# Altium schematic sheet 442MHz-450MHz_BPF.SchDoc
size A4; SheetNumber: 7; SheetTotal: 13
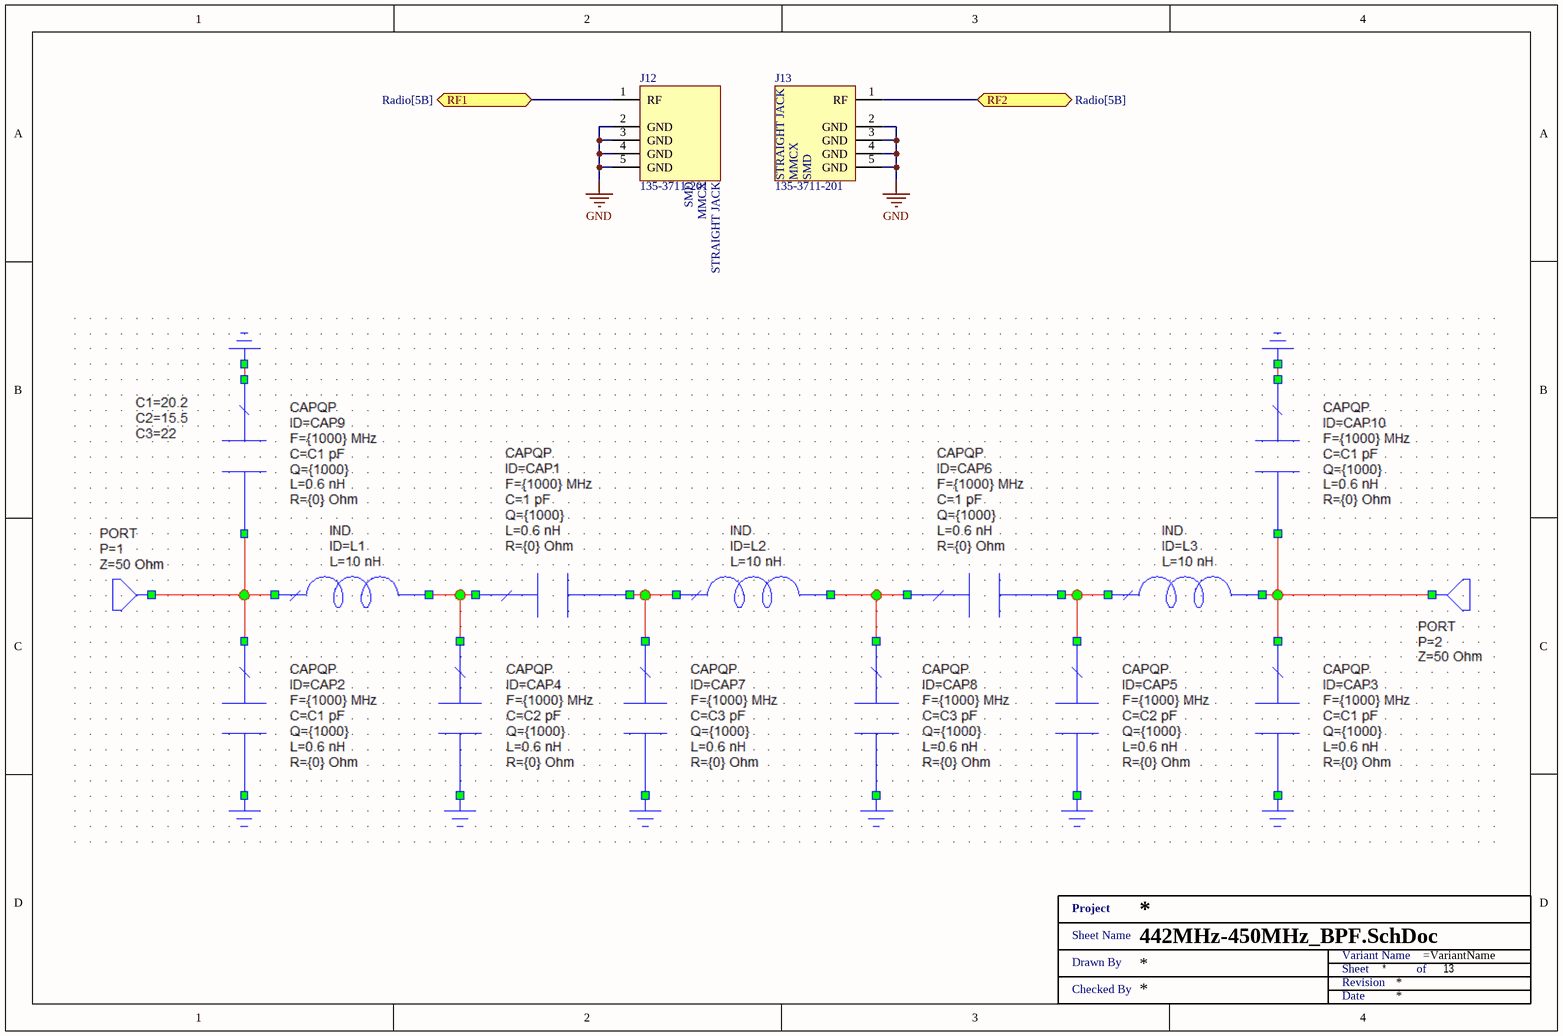
[diagram p0: 442MHz-450MHz_BPF.SchDoc]

## Parts
J12  135-3711-201  [135-3711-201]
J13  135-3711-201  [135-3711-201]
XX?  Title 1  (value not drawn)  (graphical)

## Ports
RF1 (bidir, see Radio[5B]), RF2 (bidir, see Radio[5B])

## Nets
GND: J12.2(GND) J12.3(GND) J12.4(GND) J12.5(GND) J13.2(GND) J13.3(GND) J13.4(GND) J13.5(GND)
RF1: J12.1(RF) ; port RF1
RF2: J13.1(RF) ; port RF2

## Notes on the sheet
- (in symbol 135-3711-201) SMD; MMCX; STRAIGHT JACK
- (in symbol Title 1) Project; Sheet Name; Variant Name; Drawn By; Sheet; of; Revision; Checked By; Date

## Library data of the parts
J12 J13 = 135-3711-201: MMCX -   50 Ohm Connectors; Manufacturer: JOHNSON - CINCH CONNECTIVITY; Supplier 1: Mouser; Supplier Part Number 1: 530-135-3711-201; Manufacturer Part Number: 135-3711-201; RoHS: No; Stock 1: 1530; Pricing 1: 1=4.04000, 10=3.40000, 50=3.40000, 100=3.23000, 1000=2.95000, 10000=2.18000 (USD); ComponentLink1URL: http://www.farnell.com/datasheets/2341587.pdf?src-supplier=Farnell; ComponentLink1Description: http://www.farnell.com/datasheets/2341587.pdf?src-supplier=Farnell; ComponentLink2URL: http://www.farnell.com/datasheets/2341587.pdf?src-supplier=Newark; ComponentLink2Description: http://www.farnell.com/datasheets/2341587.pdf?src-supplier=Newark; Supplier 2: Farnell; Supplier Part Number 2: 1417969; Supplier 3: Arrow Electronics; Supplier Part Number 3: 135-3711-201